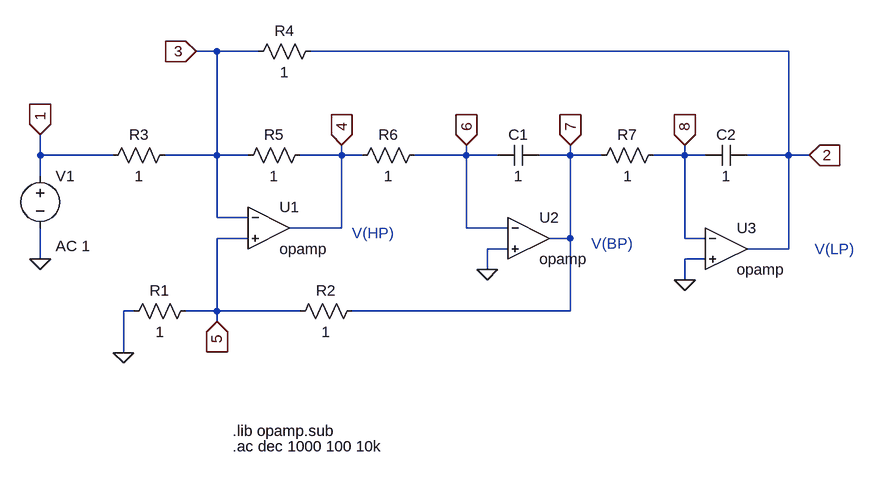
[diagram p0: schematic state_variable_filter_1kHz_Q40.asc]
state_variable_filter_1kHz_Q40.asc, the LTspice schematic file:
Version 4
SHEET 1 1784 776
WIRE 112 -16 80 -16
WIRE 176 -16 112 -16
WIRE 992 -16 256 -16
WIRE -160 144 -160 112
WIRE -48 144 -160 144
WIRE 112 144 112 -16
WIRE 112 144 32 144
WIRE 160 144 112 144
WIRE 304 144 304 128
WIRE 304 144 240 144
WIRE 336 144 304 144
WIRE 496 144 496 128
WIRE 496 144 416 144
WIRE 544 144 496 144
WIRE 656 144 656 128
WIRE 656 144 608 144
WIRE 704 144 656 144
WIRE 832 144 832 128
WIRE 832 144 784 144
WIRE 864 144 832 144
WIRE 992 144 992 -16
WIRE 992 144 928 144
WIRE 1024 144 992 144
WIRE -160 176 -160 144
WIRE 112 240 112 144
WIRE 160 240 112 240
WIRE 304 256 304 144
WIRE 304 256 224 256
WIRE 496 256 496 144
WIRE 560 256 496 256
WIRE 160 272 112 272
WIRE 656 272 656 144
WIRE 656 272 624 272
WIRE 832 272 832 144
WIRE 864 272 832 272
WIRE 560 288 528 288
WIRE 992 288 992 144
WIRE 992 288 928 288
WIRE -160 304 -160 256
WIRE 864 304 832 304
WIRE 528 320 528 288
WIRE 832 336 832 304
WIRE -16 384 -32 384
WIRE 112 384 112 272
WIRE 112 384 64 384
WIRE 240 384 112 384
WIRE 656 384 656 272
WIRE 656 384 320 384
WIRE 112 400 112 384
WIRE -32 448 -32 384
FLAG -160 304 0
FLAG 528 320 0
FLAG 832 336 0
FLAG -160 112 1
IOPIN -160 112 In
FLAG 112 400 5
IOPIN 112 400 In
FLAG 80 -16 3
IOPIN 80 -16 In
FLAG 656 128 7
IOPIN 656 128 In
FLAG 304 128 4
IOPIN 304 128 In
FLAG 496 128 6
IOPIN 496 128 In
FLAG -32 448 0
FLAG 1024 144 2
IOPIN 1024 144 In
FLAG 832 128 8
IOPIN 832 128 In
SYMBOL res 48 128 R90
WINDOW 0 0 56 VBottom 2
WINDOW 3 32 56 VTop 2
SYMATTR InstName R3
SYMATTR Value 1
SYMBOL res 432 128 R90
WINDOW 0 0 56 VBottom 2
WINDOW 3 32 56 VTop 2
SYMATTR InstName R6
SYMATTR Value 1
SYMBOL res 800 128 R90
WINDOW 0 0 56 VBottom 2
WINDOW 3 32 56 VTop 2
SYMATTR InstName R7
SYMATTR Value 1
SYMBOL res 256 128 R90
WINDOW 0 0 56 VBottom 2
WINDOW 3 32 56 VTop 2
SYMATTR InstName R5
SYMATTR Value 1
SYMBOL res 336 368 R90
WINDOW 0 0 56 VBottom 2
WINDOW 3 32 56 VTop 2
SYMATTR InstName R2
SYMATTR Value 1
SYMBOL cap 608 128 R90
WINDOW 0 0 32 VBottom 2
WINDOW 3 32 32 VTop 2
SYMATTR InstName C1
SYMATTR Value 1
SYMBOL cap 928 128 R90
WINDOW 0 0 32 VBottom 2
WINDOW 3 32 32 VTop 2
SYMATTR InstName C2
SYMATTR Value 1
SYMBOL OpAmps\\opamp 192 192 R0
SYMATTR InstName U1
SYMBOL OpAmps\\opamp 592 208 R0
SYMATTR InstName U2
SYMBOL voltage -160 160 R0
WINDOW 123 24 124 Left 2
WINDOW 39 0 0 Left 0
SYMATTR Value2 AC 1
SYMATTR InstName V1
SYMATTR Value ""
SYMBOL OpAmps\\opamp 896 224 R0
SYMATTR InstName U3
SYMBOL res 80 368 R90
WINDOW 0 0 56 VBottom 2
WINDOW 3 32 56 VTop 2
SYMATTR InstName R1
SYMATTR Value 1
SYMBOL res 272 -32 R90
WINDOW 0 0 56 VBottom 2
WINDOW 3 32 56 VTop 2
SYMATTR InstName R4
SYMATTR Value 1
TEXT 136 568 Left 2 !.lib opamp.sub
TEXT 136 592 Left 2 !.ac dec 1000 100 10k
TEXT 1032 288 Left 2 ;V(LP)
TEXT 688 280 Left 2 ;V(BP)
TEXT 320 264 Left 2 ;V(HP)

The netlist it stands for:
* state_variable_filter_1kHz_Q40.asc
R3 3 1 1
R6 6 4 1
R7 8 7 1
R5 4 3 1
R2 7 5 1
C1 7 6 1
C2 2 8 1
XU1 3 5 4 opamp Aol=100K GBW=10Meg  ; pins invin noninvin out
XU2 6 0 7 opamp Aol=100K GBW=10Meg  ; pins invin noninvin out
V1 1 0 AC 1
XU3 8 0 2 opamp Aol=100K GBW=10Meg  ; pins invin noninvin out
R1 5 0 1
R4 2 3 1
.lib opamp.sub
.ac dec 1000 100 10k
* V(LP)
* V(BP)
* V(HP)
.backanno
.end